# EAGLE design BPW5038-MicroJoystick-Wing (EAGLE 6.5.0)
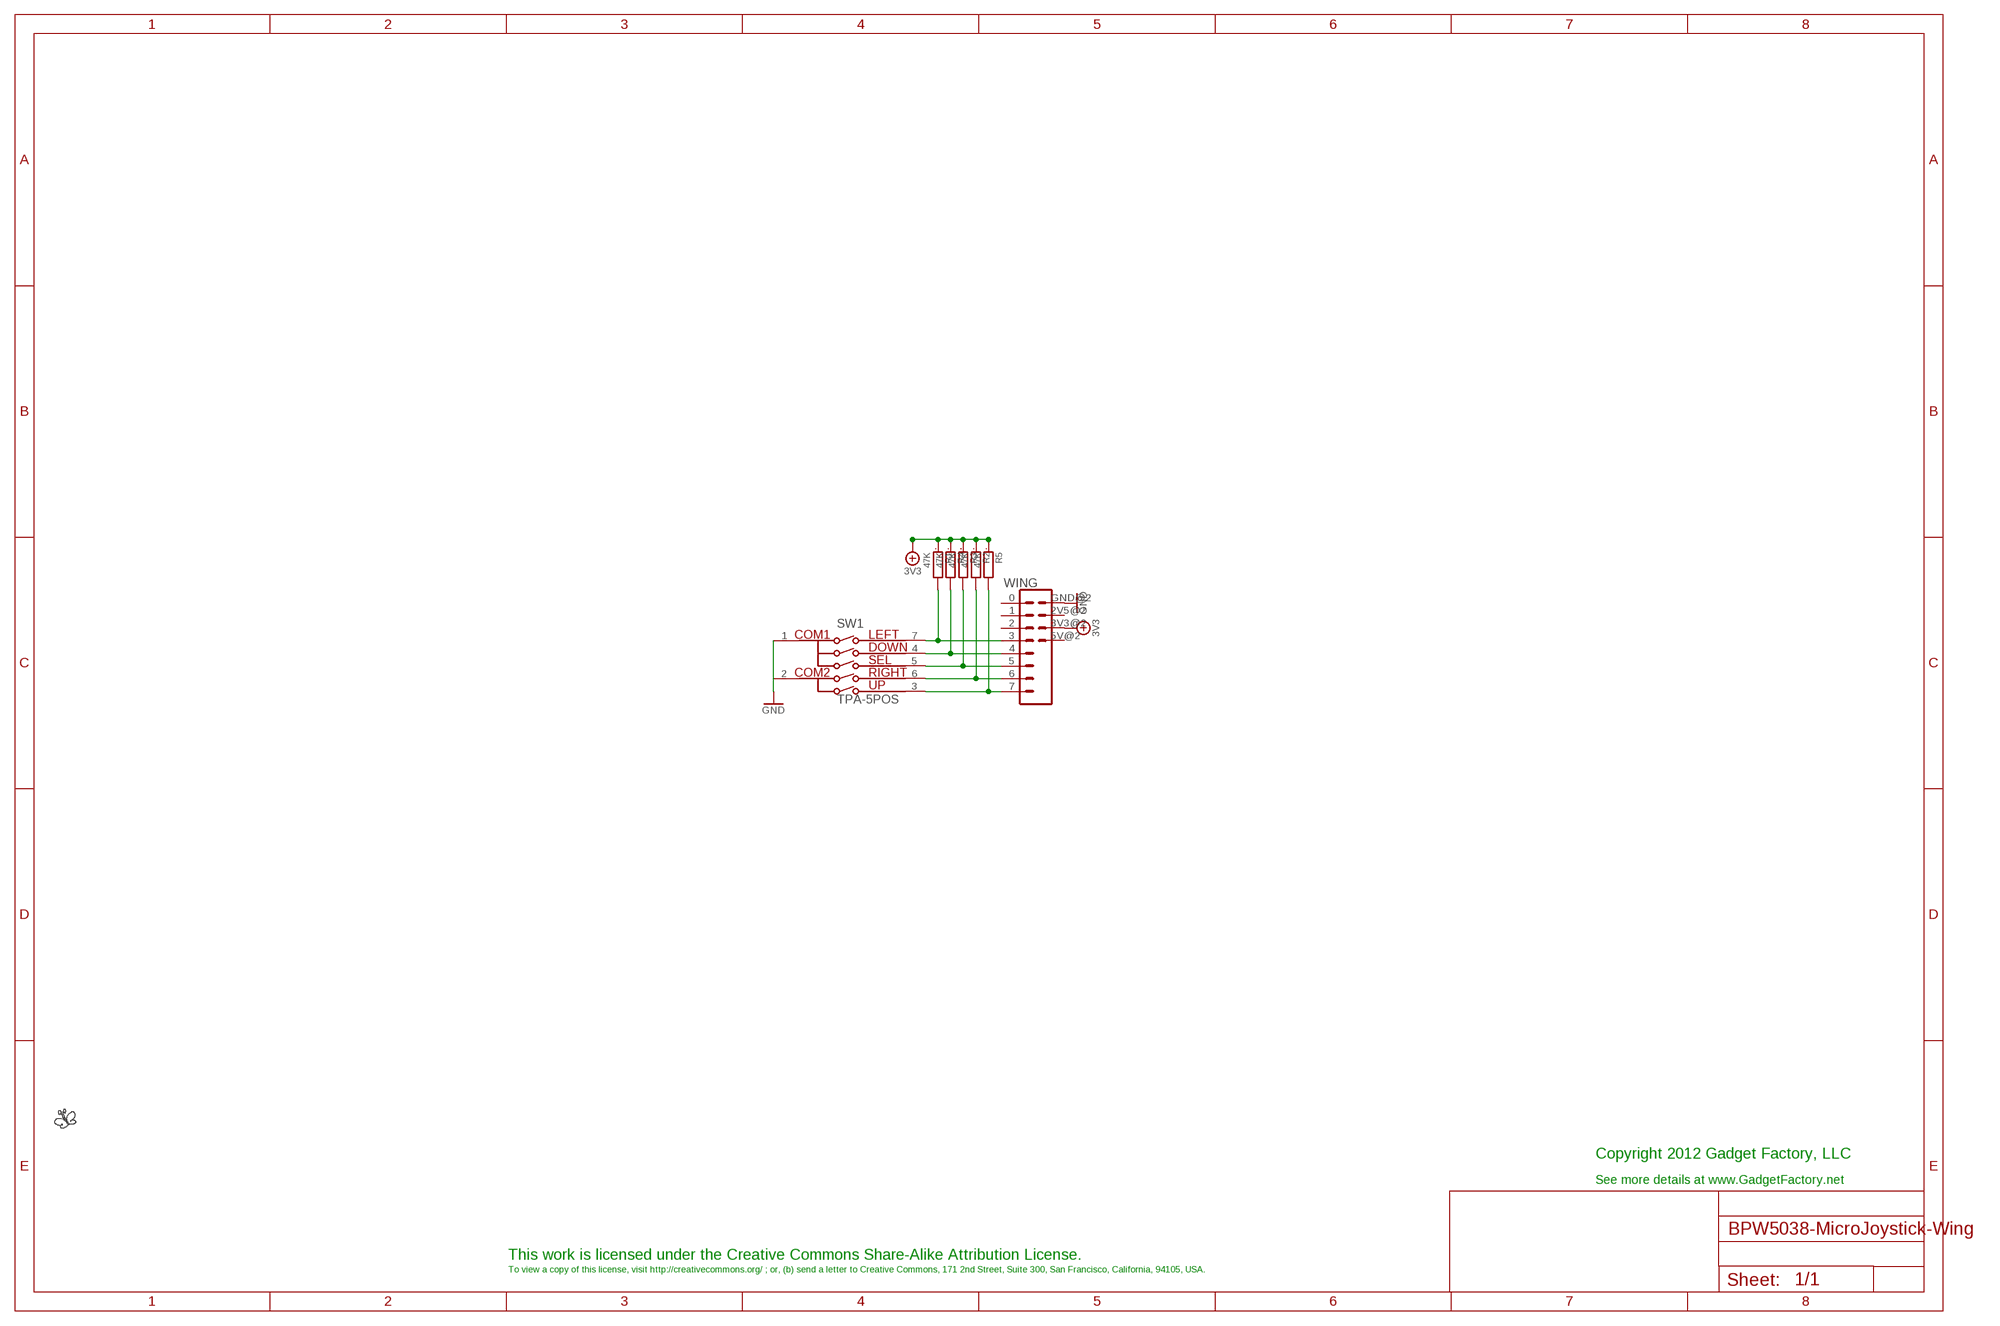
[diagram p0: schematic, sheet 1]

## Parts
LOGO1  BUTTERFLY_LOGO  [BUTTERFLY_LOGO]
R1  47K  R0603  [0603]
R2  47K  R0603  [0603]
R3  47K  R0603  [0603]
R4  47K  R0603  [0603]
R5  47K  R0603  [0603]
SW1  TPA-5POS  [TPA-5POS]
WING  WING8  [WINGSIDE_8BIT]

## Nets
3V3: R1.1 R2.1 R3.1 R4.1 R5.1 WING.3V3@2(3V3)
GND: SW1.1(COM1) SW1.2(COM2) WING.GND@2(GND)
N$1: R4.2 SW1.4(DOWN) WING.4
N$2: R1.2 SW1.7(LEFT) WING.3
N$3: R2.2 SW1.6(RIGHT) WING.6
N$4: R3.2 SW1.5(SELECT) WING.5
N$5: R5.2 SW1.3(UP) WING.7
Unconnected: WING.0 WING.1 WING.2 WING.2V5@2(2V5) WING.5V@2(5V)

## Notes on the sheet
- Copyright 2012 Gadget Factory, LLC
- See more details at www.GadgetFactory.net
- This work is licensed under the Creative Commons Share-Alike Attribution License.
- To view a copy of this license, visit http://creativecommons.org/ ; or, (b) send a letter to Creative Commons, 171 2nd Street, Suite 300, San Francisco, California, 94105, USA.

## Library data of the parts
LOGO1 = GadgetFactory_Pub:BUTTERFLY_LOGO
R1-R5 = GadgetFactory:R: RESISTOR, European symbol
SW1 = GadgetFactory:TPA-5POS: Navigation switch, 4 directions with select Digikey part: 401-1130-1-ND
WING = Papilio:WING8

## Board
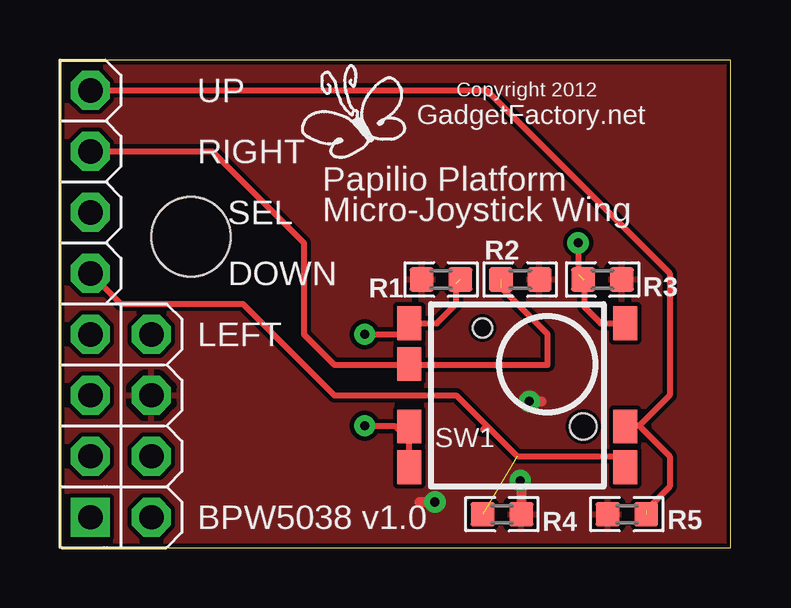
[diagram p1: board, top side]
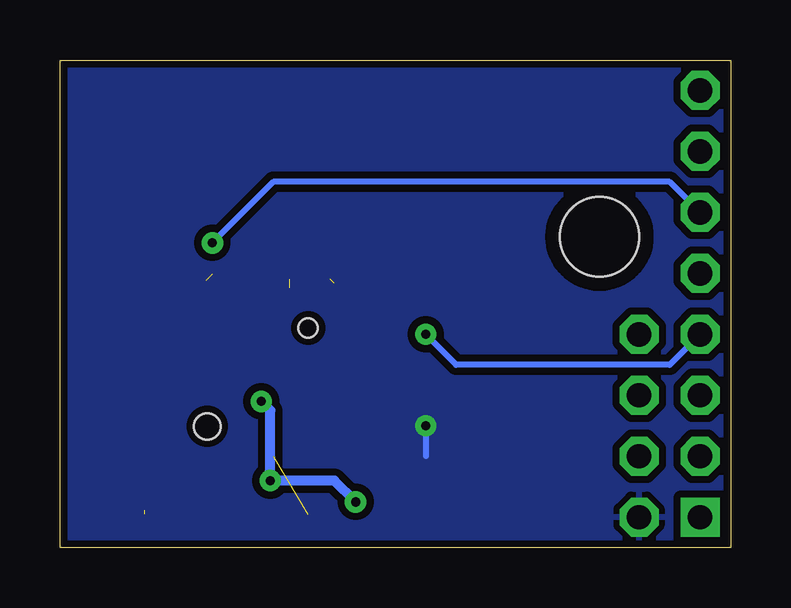
[diagram p2: board, bottom side, seen from below]

Size 27.94 x 20.32 mm. Coordinates in mm from the lower left corner, seen from the top.
Outline: 0,0 27.94,0 27.94,20.32 0,20.32 0,0
Copper layers (1*16): Top 0.035mm / dielectric 1.5mm / Bottom 0.035mm
Design rules "SparkFun_Derived_GoldePheonix_7mil": minimum track width 7mil, minimum drill 15mil, track to track 7mil, track to pad 7mil, pad to pad 7mil, via to via 7mil, smd to smd 7mil, copper to edge 7mil, drill to drill 7mil, minimum pad ring 12mil, minimum via ring 10mil, stop-mask expansion 4mil, vias tented up to drill 18mil, thermal gap 10mil

### Footprints (pad centres in the part's own frame; a part is rotated, then mirrored left to right if it is on the bottom)
0603 = smd 1 x 1: 1 -0.8,0; 2 0.8,0
TPA-5POS = smd 1 x 1.4: 1 -4.5,-3; 2 -4.5,-1.3; 3 4.5,-1.3; 4 4.5,-3; 5 4.5,3; 6 -4.5,1.3; 7 -4.5,3 | hole 0.8: -1.45,2.8 | hole 1.1: 2.75,-1.3
WINGSIDE_8BIT = drill 1.016 square: 0 19.05,1.27 | drill 1.016 octagon: 1 16.51,1.27; 2 13.97,1.27; 2V5@2 16.51,3.81; 3 11.43,1.27; 3V3@2 13.97,3.81; 4 8.89,1.27; 5 6.35,1.27; 5V@2 11.43,3.81; 6 3.81,1.27; 7 1.27,1.27; GND@2 19.05,3.81 | hole 3.302: 7.366,5.461

### Placement (x,y rotation side)
LOGO1  12.32,17.65 0 top
R1  15.88,11.18 0 top
R2  19.18,11.18 180 top
R3  22.61,11.18 180 top
R4  18.41,1.4 180 top
R5  23.62,1.4 0 top
SW1  19.05,6.35 0 top
WING  0,20.32 270 top

### Tracks (layer width: path | path; a pad name or v marks a point on that pad's centre or on a via)
3V3  (via drill 0.38)
  Top 0.406: 19.27,2.71 v19.18,2.79 19.21,2.76 R4.1 | v19.56,6.1 20.07,6.1 | 14.99,1.91 v15.62,1.91
  Bottom 0.406: v19.56,6.1 19.18,5.71 v19.18,2.79 16.51,2.79 v15.62,1.91
  pour Top: 0,20.32 27.94,20.32 27.94,0 0,0
GND  (via drill 0.38)
  Top 0.254: 13.97,5.05 SW1.2 | 13.97,5.05 12.73,5.05 v12.7,5.08 | SW1.1 14.55,4.47 13.97,5.05
  Bottom 0.254: v12.7,5.08 12.7,3.81
  pour Bottom (isolate 0.305): 0,20.32 27.94,20.32 27.94,0 0,0
N$1  (1 unrouted)
  Top 0.254: WING.4 2.54,10.16 7.62,10.16 11.43,6.35 16.51,6.35 17.78,5.08 | 17.78,5.08 19.05,3.81 23.09,3.81 SW1.4 | 17.78,5.08 17.61,4.92
N$2  (via drill 0.38)  (1 unrouted)
  Top 0.254: 16.51,11.01 16.51,10.16 15.7,9.35 SW1.7 14.09,8.89 v12.7,8.89
  Bottom 0.254: WING.3 2.54,7.62 11.43,7.62 v12.7,8.89
N$3  (1 unrouted)
  Top 0.254: WING.6 6.35,16.51 10.16,12.7 10.16,8.89 11.43,7.62 14.52,7.62 SW1.6 14.58,7.62 20.32,7.62 20.32,8.89 18.38,10.83
N$4  (via drill 0.38)  (2 unrouted)
  Top 0.254: SW1.5 22.53,9.35 21.84,10.03 21.84,11.14 | v21.59,12.7 21.59,11.39
  Bottom 0.254: WING.5 2.54,15.24 19.05,15.24 v21.59,12.7
N$5  (1 unrouted)
  Top 0.254: WING.7 17.78,19.05 25.4,11.43 25.4,6.35 24.13,5.08 | 24.13,5.08 23.58,5.08 SW1.3 | 24.42,1.56 25.4,2.54 25.4,3.81 24.13,5.08

### Text on the board
tPlace: UP | Copyright 2012 | GadgetFactory.net | RIGHT | Papilio Platform | Micro-Joystick Wing | SEL | DOWN | LEFT | BPW5038 v1.0